# Altium schematic sheet front_end.SchDoc
size A4
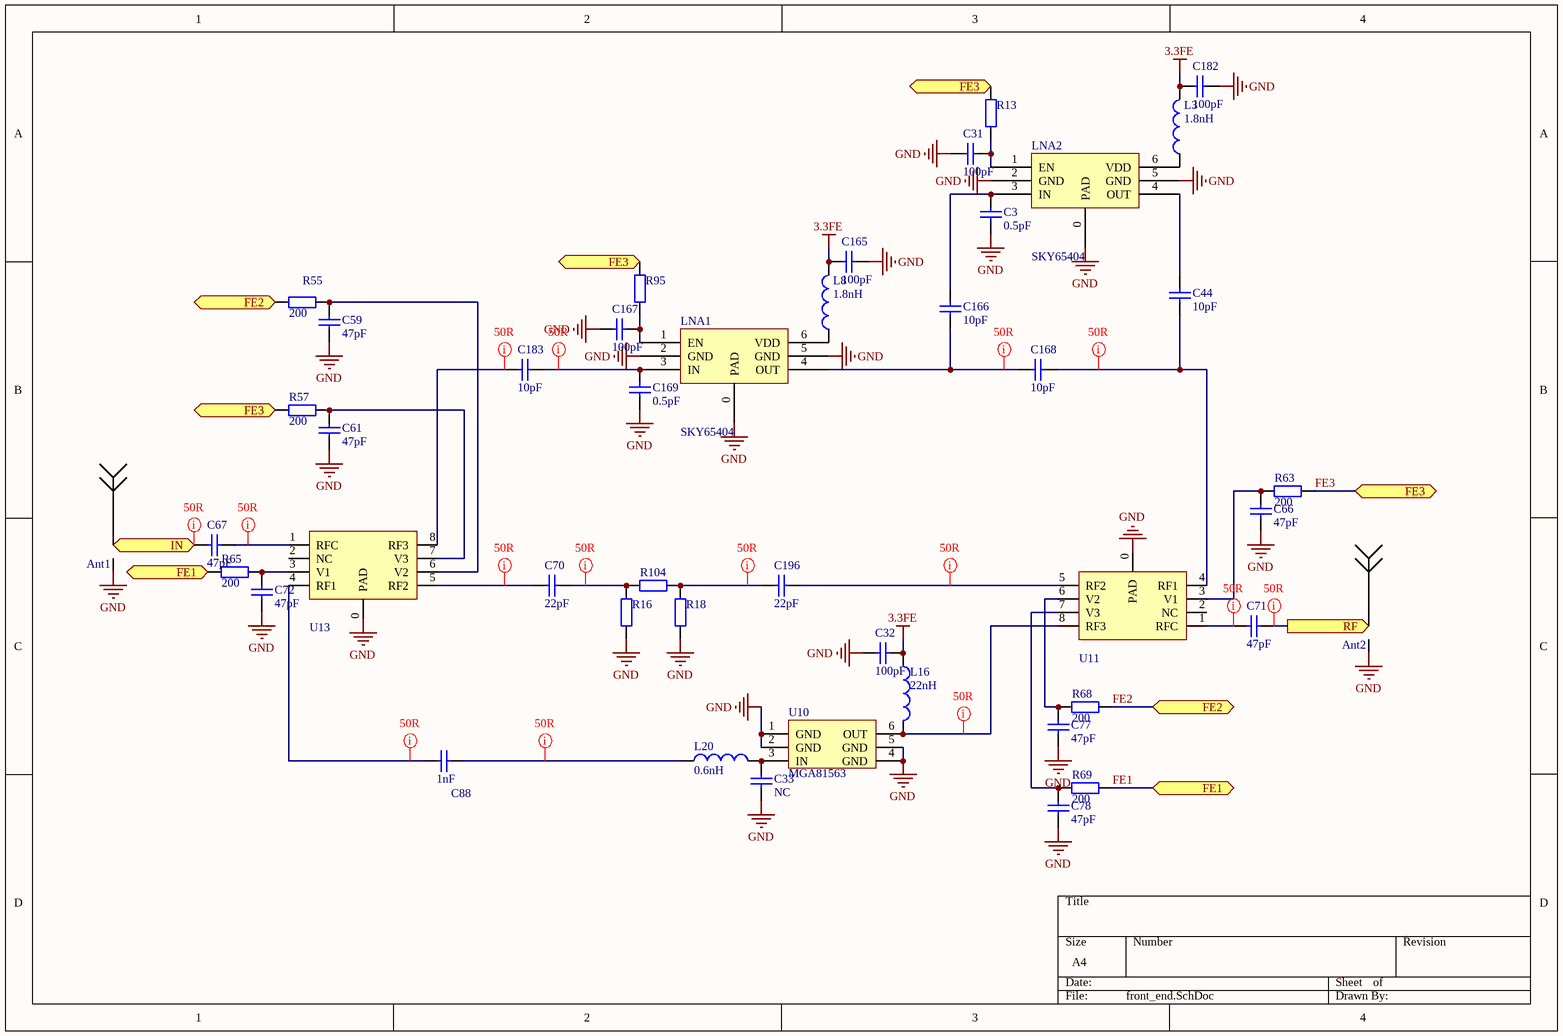
[diagram p0: front_end.SchDoc]

## Parts
Ant1  Antenna  [SMA-2]  (value not drawn)
Ant2  Antenna  [SMA-SMT]  (value not drawn)
C3  value 0.5pF  [0402]  (hidden comment: Cap)
C31  value 100pF  [0402]  (hidden comment: Cap)
C32  value 100pF  [0402]  (hidden comment: Cap)
C33  value NC  [0402]  (hidden comment: Cap)
C44  10pF  [0402]
C59  47pF  [0402]
C61  47pF  [0402]
C66  47pF  [0402]
C67  47pF  [0402]
C70  22pF  [0402]
C71  47pF  [0402]
C72  47pF  [0402]
C77  47pF  [0402]
C78  47pF  [0402]
C88  1nF  [0402]
C165  value 100pF  [0402]  (hidden comment: Cap)
C166  10pF  [0402]
C167  value 100pF  [0402]  (hidden comment: Cap)
C168  10pF  [0402]
C169  value 0.5pF  [0402]  (hidden comment: Cap)
C182  value 100pF  [0402]  (hidden comment: Cap)
C183  10pF  [0402]
C196  22pF  [0402]
L3  value 1.8nH  [0402]  (hidden comment: Inductor)
L8  value 1.8nH  [0402]  (hidden comment: Inductor)
L16  value 22nH  [0603]  (hidden comment: Inductor)
L20  value 0.6nH  [0402]  (hidden comment: Inductor)
LNA1  SKY65404  [SKY65404-31]
LNA2  SKY65404  [SKY65404-31]
R13  200R  [0402]  (value not drawn)
R16  TBD  [0402]  (value not drawn)
R18  TBD  [0402]  (value not drawn)
R55  200  [0402]
R57  200  [0402]
R63  200  [0402]
R65  200  [0402]
R68  200  [0402]
R69  200  [0402]
R95  200R  [0402]  (value not drawn)
R104  TBD  [0402]  (value not drawn)
U10  MGA81563  [SC-70-6]
U11  SKY13417  [SKY13317]  (value not drawn)
U13  SKY13417  [SKY13317]  (value not drawn)

## Ports
FE1, FE2, FE3, IN (in), RF (out)

## Nets
3.3FE: C32.2 C165.2 C182.2 L3.2 L8.2 L16.1
GND: Ant1.GND(G) Ant2.GND(G) C3.1 C31.2 C32.1 C33.1 C59.1 C61.1 C66.1 C72.1 C77.1 C78.1 C165.1 C167.2 C169.1 C182.1 LNA1.0(PAD) LNA1.2(GND) LNA1.5(GND) LNA2.0(PAD) LNA2.2(GND) LNA2.5(GND) R16.1 R18.2 U10.1(GND) U10.2(GND) U10.4(GND) U10.5(GND) U11.0(PAD) U13.0(PAD)
FE1: R65.1 R69.2 ; port FE1
FE2: R55.2 R68.2 ; port FE2
FE3: R13.2 R57.1 R63.2 R95.2 ; port FE3
IN: Ant1.1 C67.2 ; port IN
RF: Ant2.1 C71.1 ; port RF
NetC3_2: C3.2 C166.1 LNA2.3(IN)
NetC31_1: C31.1 LNA2.1(EN) R13.1
NetC33_2: C33.2 L20.2 U10.3(IN)
NetC44_1: C44.1 C168.1 U11.4(RF1)
NetC44_2: C44.2 LNA2.4(OUT)
NetC59_2: C59.2 R55.1 U13.6(V2)
NetC61_2: C61.2 R57.2 U13.7(V3)
NetC66_2: C66.2 R63.1 U11.3(V1)
NetC67_1: C67.1 U13.1(RFC)
NetC70_1: C70.1 R16.2 R104.2
NetC70_2: C70.2 U13.5(RF2)
NetC71_2: C71.2 U11.1(RFC)
NetC72_2: C72.2 R65.2 U13.3(V1)
NetC77_2: C77.2 R68.1 U11.6(V2)
NetC78_2: C78.2 R69.1 U11.7(V3)
NetC88_1: C88.1 L20.1
NetC88_2: C88.2 U13.4(RF1)
NetC166_2: C166.2 C168.2 LNA1.4(OUT)
NetC167_1: C167.1 LNA1.1(EN) R95.1
NetC169_2: C169.2 C183.2 LNA1.3(IN)
NetC183_1: C183.1 U13.8(RF3)
NetC196_1: C196.1 U11.5(RF2)
NetC196_2: C196.2 R18.1 R104.1
NetL3_1: L3.1 LNA2.6(VDD)
NetL8_1: L8.1 LNA1.6(VDD)
NetL16_2: L16.2 U10.6(OUT) U11.8(RF3)

Not connected (* = marked no-connect by the designer): U11 2(NC); U13 2(NC)

## Layout directives
net class 50R: IN, NetC44_1, NetC67_1, NetC70_1, NetC70_2, NetC71_2, NetC88_1, NetC88_2, NetC166_2, NetC169_2, NetC183_1, NetC196_1, NetC196_2, NetL16_2, RF

## Library data of the parts
C3 C31-C33 C44 C59 C61 C66 C67 C70-C72 C77 C78 C88 C165-C169 C182 C183 C196 = Cap: Capacitor; Published: 8-Jun-2000; LatestRevisionDate: 17-Jul-2002; LatestRevisionNote: Re-released for DXP Platform.; PackageReference: RAD-0.3; Publisher: Altium Limited; PackageDescription: Radial Cap, Thru-Hole; 2 Leads; 0.3 in Pin Spacing
L3 L8 L16 L20 = Inductor: Code_IEC: 1005; Published: 8-Jun-2000; LatestRevisionDate: 29-May-2009; LatestRevisionNote: IPC-7351 Footprint Added.; PackageReference: 0402-A; Publisher: Altium Limited; PackageDescription: Chip Inductor; Code_JEITA: 0402
LNA1 LNA2 = SKY65404-31
R13 R16 R18 R55 R57 R63 R65 R68 R69 R95 R104 = Res2: Resistor; Published: 8-Jun-2000; LatestRevisionDate: 17-Jul-2002; LatestRevisionNote: Re-released for DXP Platform.; PackageReference: AXIAL-0.4; Publisher: Altium Limited; PackageDescription: Axial Device, Thru-Hole; 2 Leads; 0.4 in Pin Spacing